# EAGLE schematic main (EAGLE 6.2)

## Sheet 1 of 3
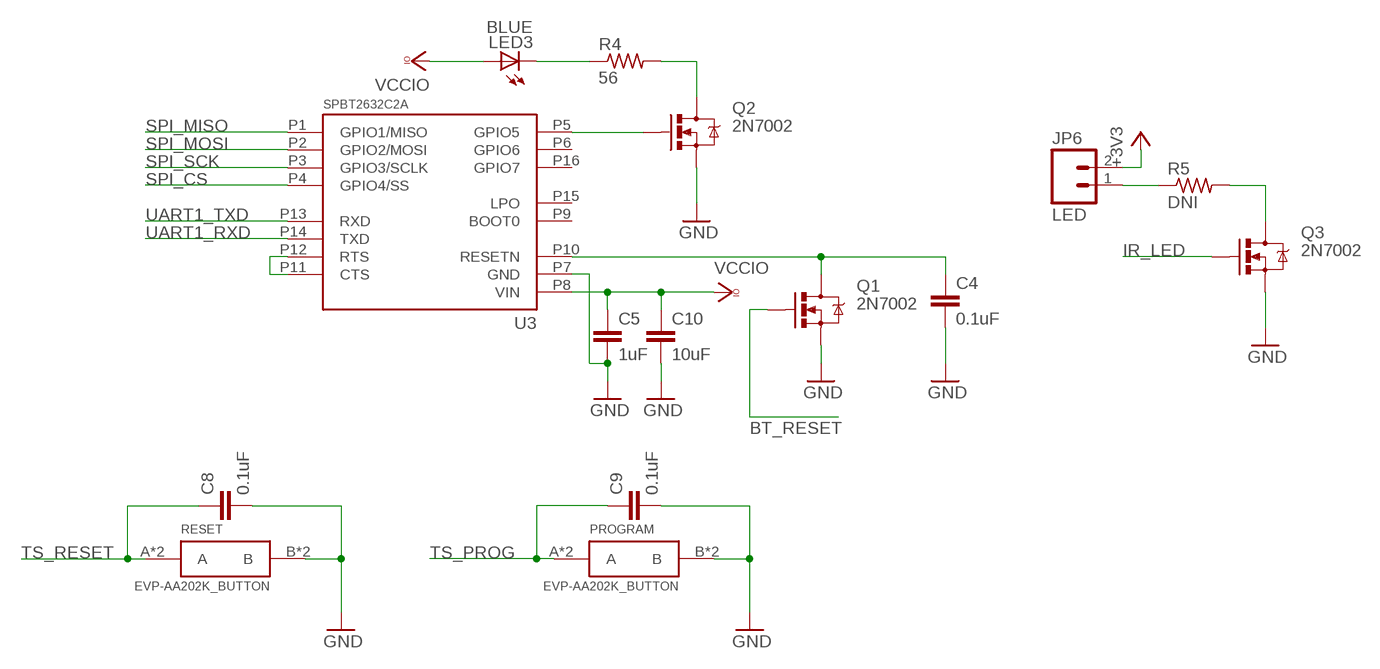
[diagram p0: schematic, sheet 1]

### Parts
C4  0.1uF  C-EUC0402  [C0402]
C5  1uF  C-EUC0402  [C0402]
C8  0.1uF  C-EUC0402  [C0402]
C9  0.1uF  C-EUC0402  [C0402]
C10  10uF  C-EUC0603  [C0603]
JP6  LED  M02LOCK_LONGPADS  [1X02_LOCK_LONGPADS]
LED3  BLUE  LEDCHIPLED_0603  [CHIPLED_0603]
PROGRAM  EVP-AA202K_BUTTON  [EVP-AA202K_4PIN]
Q1  2N7002  MOSFET-NCHANNELSMD  [SOT23-3]
Q2  2N7002  MOSFET-NCHANNELSMD  [SOT23-3]
Q3  2N7002  MOSFET-NCHANNELSMD  [SOT23-3]
R4  56  R-US_R0402  [R0402]
R5  DNI  R-US_R0402  [R0402]
RESET  EVP-AA202K_BUTTON  [EVP-AA202K_4PIN]
U3  SPBT2632C2A  [SPBT2632C2A_16PIN_SMD]

### Nets
+3V3: JP6.2 ; also sheet 2
BT_RESET: Q1.1(G) ; also sheet 2
GND: C4.2 C5.2 C8.2 C9.2 C10.2 PROGRAM.B PROGRAM.B'(B) Q1.2(S) Q2.2(S) Q3.2(S) RESET.B RESET.B'(B) U3.P7(GND) ; also sheet 2,3
IR_LED: Q3.1(G) ; also sheet 2
N$6: U3.P11(CTS) U3.P12(RTS)
N$7: C4.1 Q1.3(D) U3.P10(RESETN)
N$8: Q2.1(G) U3.P5(GPIO5)
N$9: LED3.C R4.1
N$10: Q2.3(D) R4.2
N$11: JP6.1 R5.1
N$12: Q3.3(D) R5.2
SPI_CS: U3.P4(GPIO4/SS) ; also sheet 2
SPI_MISO: U3.P1(GPIO1/MISO) ; also sheet 2
SPI_MOSI: U3.P2(GPIO2/MOSI) ; also sheet 2
SPI_SCK: U3.P3(GPIO3/SCLK) ; also sheet 2
TS_PROG: C9.1 PROGRAM.A PROGRAM.A'(A) ; also sheet 2
TS_RESET: C8.1 RESET.A RESET.A'(A) ; also sheet 2
UART1_RXD: U3.P14(TXD) ; also sheet 2
UART1_TXD: U3.P13(RXD) ; also sheet 2
VCCIO: C5.1 C10.1 LED3.A U3.P8(VIN) ; also sheet 2,3
Unconnected: U3.P6(GPIO6) U3.P9(BOOT0) U3.P15(LPO) U3.P16(GPIO7)

## Sheet 2 of 3
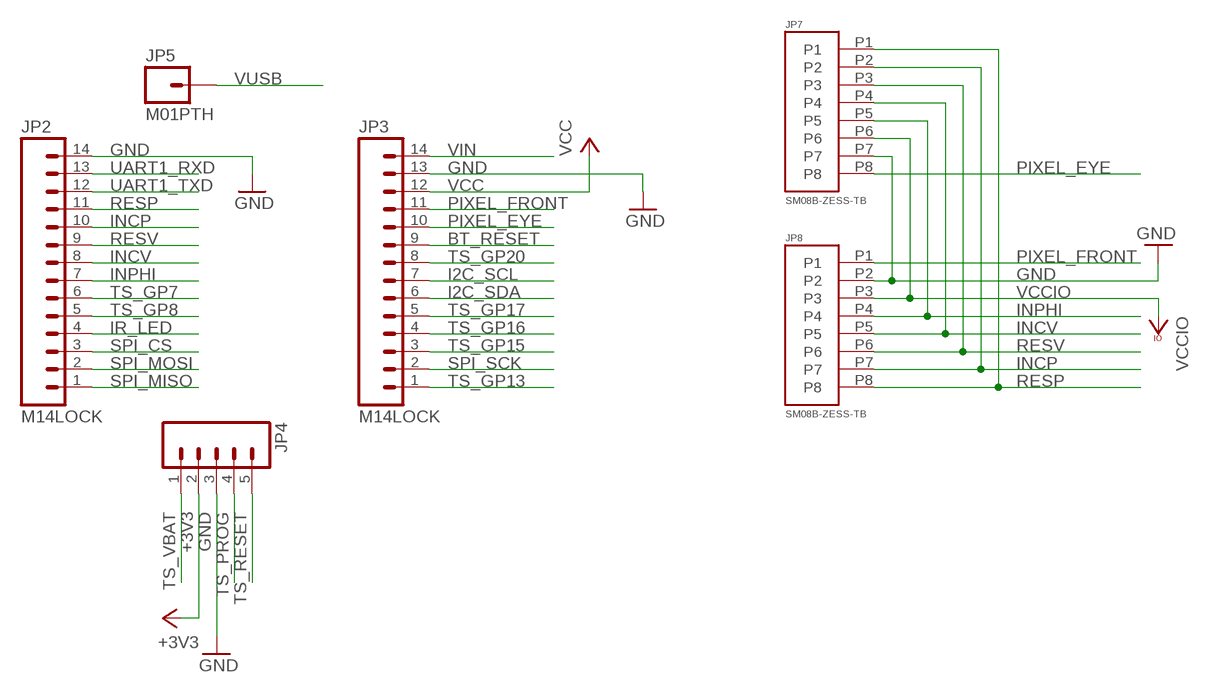
[diagram p1: schematic, sheet 2]

### Parts
JP2  M14LOCK  [1X14_LOCK]
JP3  M14LOCK  [1X14_LOCK]
JP4  M05LOCK  [1X05_LOCK]
JP5  M01PTH  [1X01]
JP7  SM08B-ZESS-TB  [SM08B_8PIN_SMD]
JP8  SM08B-ZESS-TB  [SM08B_8PIN_SMD]

### Nets
+3V3: JP4.2 ; also sheet 1
BT_RESET: JP3.9 ; also sheet 1
GND: JP2.14 JP3.13 JP4.3 JP7.P7 JP8.P2 ; also sheet 1,3
I2C_SCL: JP3.7 ; also sheet 3
I2C_SDA: JP3.6 ; also sheet 3
INCP: JP2.10 JP7.P2 JP8.P7
INCV: JP2.8 JP7.P4 JP8.P5
INPHI: JP2.7 JP7.P5 JP8.P4
IR_LED: JP2.4 ; also sheet 1
PIXEL_EYE: JP3.10 JP7.P8
PIXEL_FRONT: JP3.11 JP8.P1
RESP: JP2.11 JP7.P1 JP8.P8
RESV: JP2.9 JP7.P3 JP8.P6
SPI_CS: JP2.3 ; also sheet 1
SPI_MISO: JP2.1 ; also sheet 1
SPI_MOSI: JP2.2 ; also sheet 1
SPI_SCK: JP3.2 ; also sheet 1
TS_GP7: JP2.6
TS_GP8: JP2.5
TS_GP13: JP3.1
TS_GP15: JP3.3
TS_GP16: JP3.4
TS_GP17: JP3.5
TS_GP20: JP3.8
TS_PROG: JP4.4 ; also sheet 1
TS_RESET: JP4.5 ; also sheet 1
TS_VBAT: JP4.1
UART1_RXD: JP2.13 ; also sheet 1
UART1_TXD: JP2.12 ; also sheet 1
VCC: JP3.12
VCCIO: JP7.P6 JP8.P3 ; also sheet 1,3
VIN: JP3.14 ; also sheet 3
VUSB: JP5.1 ; also sheet 3

## Sheet 3 of 3
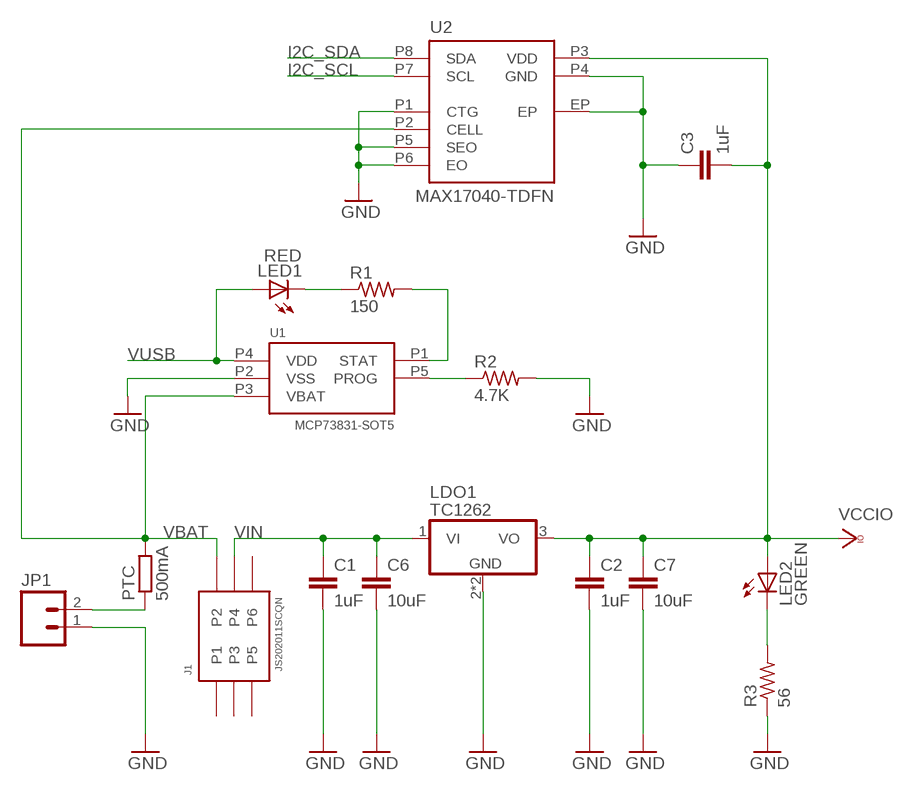
[diagram p2: schematic, sheet 3]

### Parts
C1  1uF  C-EUC0402  [C0402]
C2  1uF  C-EUC0402  [C0402]
C3  1uF  C-EUC0402  [C0402]
C6  10uF  C-EUC0603  [C0603]
C7  10uF  C-EUC0603  [C0603]
J1  JS202011SCQN  [JS2020_6PIN_SMT]
JP1  M02-JST-2MM-SMT  [JST-2-SMD]
LDO1  TC1262  MCP1703DB  [SOT223]
LED1  RED  LEDCHIPLED_0603  [CHIPLED_0603]
LED2  GREEN  LEDCHIPLED_0603  [CHIPLED_0603]
PTC  500mA  R-EU_R0402  [R0402]
R1  150  R-US_R0402  [R0402]
R2  4.7K  R-US_R0402  [R0402]
R3  56  R-US_R0402  [R0402]
U1  MCP73831-SOT5  [SOT23-5]
U2  MAX17040-TDFN  [TDFN_8PIN]

### Nets
GND: C1.2 C2.2 C3.1 C6.2 C7.2 JP1.1 LDO1.2(GND) LDO1.4(GND) R2.2 R3.1 U1.P2(VSS) U2.EP U2.P1(CTG) U2.P4(GND) U2.P5(SEO) U2.P6(EO) ; also sheet 1,2
I2C_SCL: U2.P7(SCL) ; also sheet 2
I2C_SDA: U2.P8(SDA) ; also sheet 2
N$1: LED1.C R1.1
N$2: R1.2 U1.P1(STAT)
N$3: R2.1 U1.P5(PROG)
N$4: JP1.2 PTC.1
N$5: LED2.C R3.2
VBAT: J1.P2 PTC.2 U1.P3(VBAT) U2.P2(CELL)
VCCIO: C2.1 C3.2 C7.1 LDO1.3(VO) LED2.A U2.P3(VDD) ; also sheet 1,2
VIN: C1.1 C6.1 J1.P4 LDO1.1(VI) ; also sheet 2
VUSB: LED1.A U1.P4(VDD) ; also sheet 2
Unconnected: J1.P1 J1.P3 J1.P5 J1.P6

## Library data of the parts
C1-C10 = resistor:C-EU: CAPACITOR, European symbol
J1 = glasses:JS202011SCQN
JP1 JP6 = SparkFun:M02: Header 2 Standard 2-pin 0.1" header. Use with straight break away headers (SKU : PRT-00116), right angle break away headers (PRT-00553), swiss pins (PRT-00743), machine pins (PRT-00117), and female headers (PRT-00115). Molex polarized connector foot print use with SKU : PRT-08233 with associated crimp pins and housings.
JP2 JP3 = SparkFun:M14: Header 14 Standard 14-pin 0.1" header. Use with straight break away headers (SKU : PRT-00116), right angle break away headers (PRT-00553), swiss pins (PRT-00743), machine pins (PRT-00117), and female headers (PRT-00115).
JP4 = SparkFun:M05: Header 5 Standard 5-pin 0.1" header. Use with straight break away headers (SKU : PRT-00116), right angle break away headers (PRT-00553), swiss pins (PRT-00743), machine pins (PRT-00117), and female headers (PRT-00115). Molex polarized connector foot print use with SKU : PRT-08230 with associated crimp pins and housings.
JP5 = SparkFun:M01: Header 1 Standard 1-pin 0.1" header. Use with straight break away headers (SKU : PRT-00116), right angle break away headers (PRT-00553), swiss pins (PRT-00743), machine pins (PRT-00117), and female headers (PRT-00115).
JP7 JP8 = glasses:SM08B-ZESS-TB
LDO1 = glasses:MCP1703: 250 mA, 16V, Low Quiescent Current LDO Regulator Source: http://ww1.microchip.com/downloads/en/DeviceDoc/22049b.pdf
LED1-LED3 = led:LED: LED OSRAM: - CHIPLED LG R971, LG N971, LY N971, LG Q971, LY Q971, LO R971, LY R971 LH N974, LH R974 LS Q976, LO Q976, LY Q976 LO Q996 - Hyper CHIPLED LW Q18S LB Q993, LB Q99A, LB R99A - SideLED LS A670, LO A670, LY A670, LG A670, LP A670 LB A673, LV A673, LT A673, LW A673 LH A674 LY A675 LS A676, LA A676, LO A676, LY A676, LW A676 LS A679, LY A679, LG A679 - Hyper Micro SIDELED® LS Y876, LA Y876, LO Y876, LY Y876 LT Y87S - SmartLED LW L88C, LW L88S LB L89C, LB L89S, LG L890 LS L89K, LO L89K, LY L89K LS L896, LA L896, LO L896, LY L896 - TOPLED LS T670, LO T670, LY T670, LG T670, LP T670 LSG T670, LSP T670, LSY T670, LOP T670, LYG T670 LG T671, LOG T671, LSG T671 LB T673, LV T673, LT T673, LW T673 LH T674 LS T676, LA T676, LO T676, LY T676, LB T676, LH T676, LSB T676, LW T676 LB T67C, LV T67C, LT T67C, LS T67K, LO T67K, LY T67K, LW E67C LS E67B, LA E67B, LO E67B, LY E67B, LB E67C, LV E67C, LT E67C LW T67C LS T679, LY T679, LG T679 LS T770, LO T770, LY T770, LG T770, LP T770 LB T773, LV T773, LT T773, LW T773 LH T774 LS E675, LA E675, LY E675, LS T675 LS T776, LA T776, LO T776, LY T776, LB T776 LHGB T686 LT T68C, LB T68C - Hyper Mini TOPLED® LB M676 - Mini TOPLED Santana® LG M470 LS M47K, LO M47K, LY M47K Source: http://www.osram.convergy.de LUXEON: - LUMILED® LXK2-PW12-R00, LXK2-PW12-S00, LXK2-PW14-U00, LXK2-PW14-V00 LXK2-PM12-R00, LXK2-PM12-S00, LXK2-PM14-U00 LXK2-PE12-Q00, LXK2-PE12-R00, LXK2-PE12-S00, LXK2-PE14-T00, LXK2-PE14-U00 LXK2-PB12-K00, LXK2-PB12-L00, LXK2-PB12-M00, LXK2-PB14-N00, LXK2-PB14-P00, LXK2-PB14-Q00 LXK2-PR12-L00, LXK2-PR12-M00, LXK2-PR14-Q00, LXK2-PR14-R00 LXK2-PD12-Q00, LXK2-PD12-R00, LXK2-PD12-S00 LXK2-PH12-R00, LXK2-PH12-S00 LXK2-PL12-P00, LXK2-PL12-Q00, LXK2-PL12-R00 Source: www.luxeon.com KINGBRIGHT: KA-3528ASYC Source: www.kingbright.com
PROGRAM RESET = glasses:EVP-AA202K_BUTTON
PTC = resistor:R-EU_: RESISTOR, European symbol
Q1-Q3 = SparkFun:MOSFET-NCHANNEL
R1-R5 = resistor:R-US_: RESISTOR, American symbol
U1 = glasses:MCP73831-SOT5
U2 = glasses:MAX17040-TDFN
U3 = glasses:SPBT2632C2A